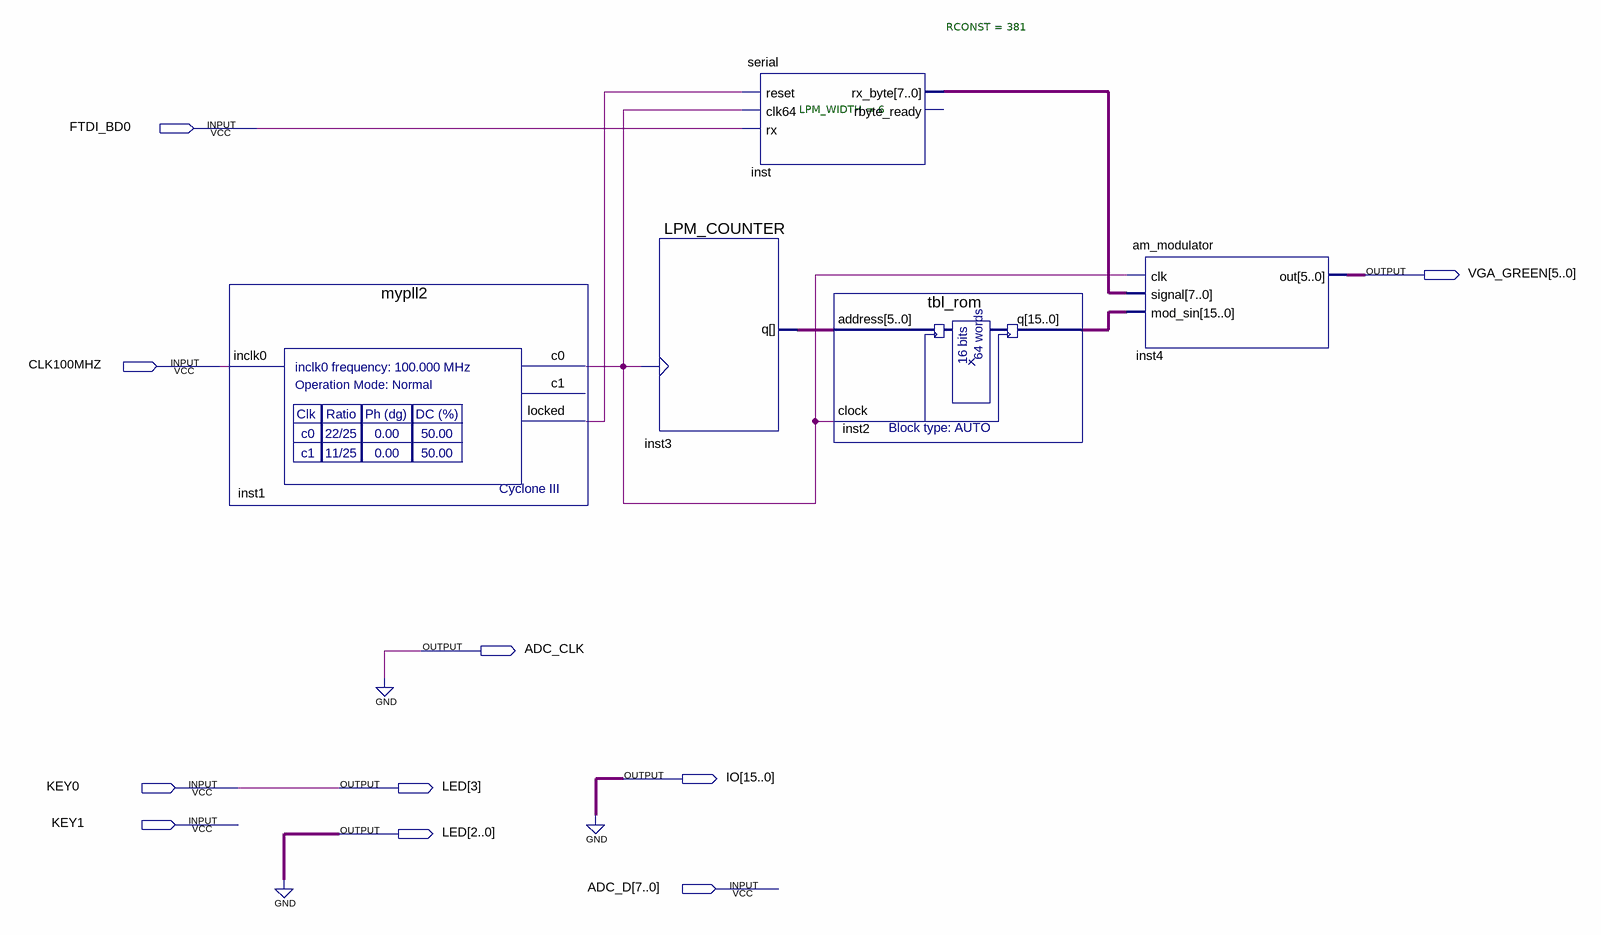
[diagram p0: schematic sheet]
// Quartus schematic cyclone3.bdf as structural Verilog: 5 symbols, 10 pins
module cyclone3 (
  input  FTDI_BD0,
  input  CLK100MHZ,
  input  KEY0,
  input  KEY1,
  input  [7:0] ADC_D,
  output [5:0] VGA_GREEN,
  output ADC_CLK,
  output [15:0] IO,
  output [3:0] LED
);

  wire inst1_c0, inst1_locked, inst1_locked_inverted_out;
  wire [5:0] inst3_q;
  wire [7:0] inst_rx_byte;
  wire [15:0] inst2_q;

  mypll2 inst1 (.inclk0(CLK100MHZ), .c0(inst1_c0), .locked(inst1_locked));  // open: c1
  not inst1_locked_inverted (inst1_locked_inverted_out, inst1_locked);
  LPM_COUNTER #(.LPM_WIDTH(6)) inst3 (.clock(inst1_c0), .q(inst3_q));
  serial #(.RCONST(381)) inst (
    .reset(inst1_locked_inverted_out), .clk64(inst1_c0), .rx(FTDI_BD0), .rx_byte(inst_rx_byte));  // open: rbyte_ready
  tbl_rom inst2 (.address(inst3_q), .clock(inst1_c0), .q(inst2_q));
  am_modulator inst4 (.clk(inst1_c0), .signal(inst_rx_byte), .mod_sin(inst2_q), .out(VGA_GREEN));

  assign ADC_CLK = 1'b0;
  assign IO = {16{1'b0}};
  assign LED = {KEY0, 3'b000};
endmodule
